# Altium schematic sheet fpga33-serdes-power.SchDoc
size Tabloid; SheetNumber: 70; SheetTotal: 71
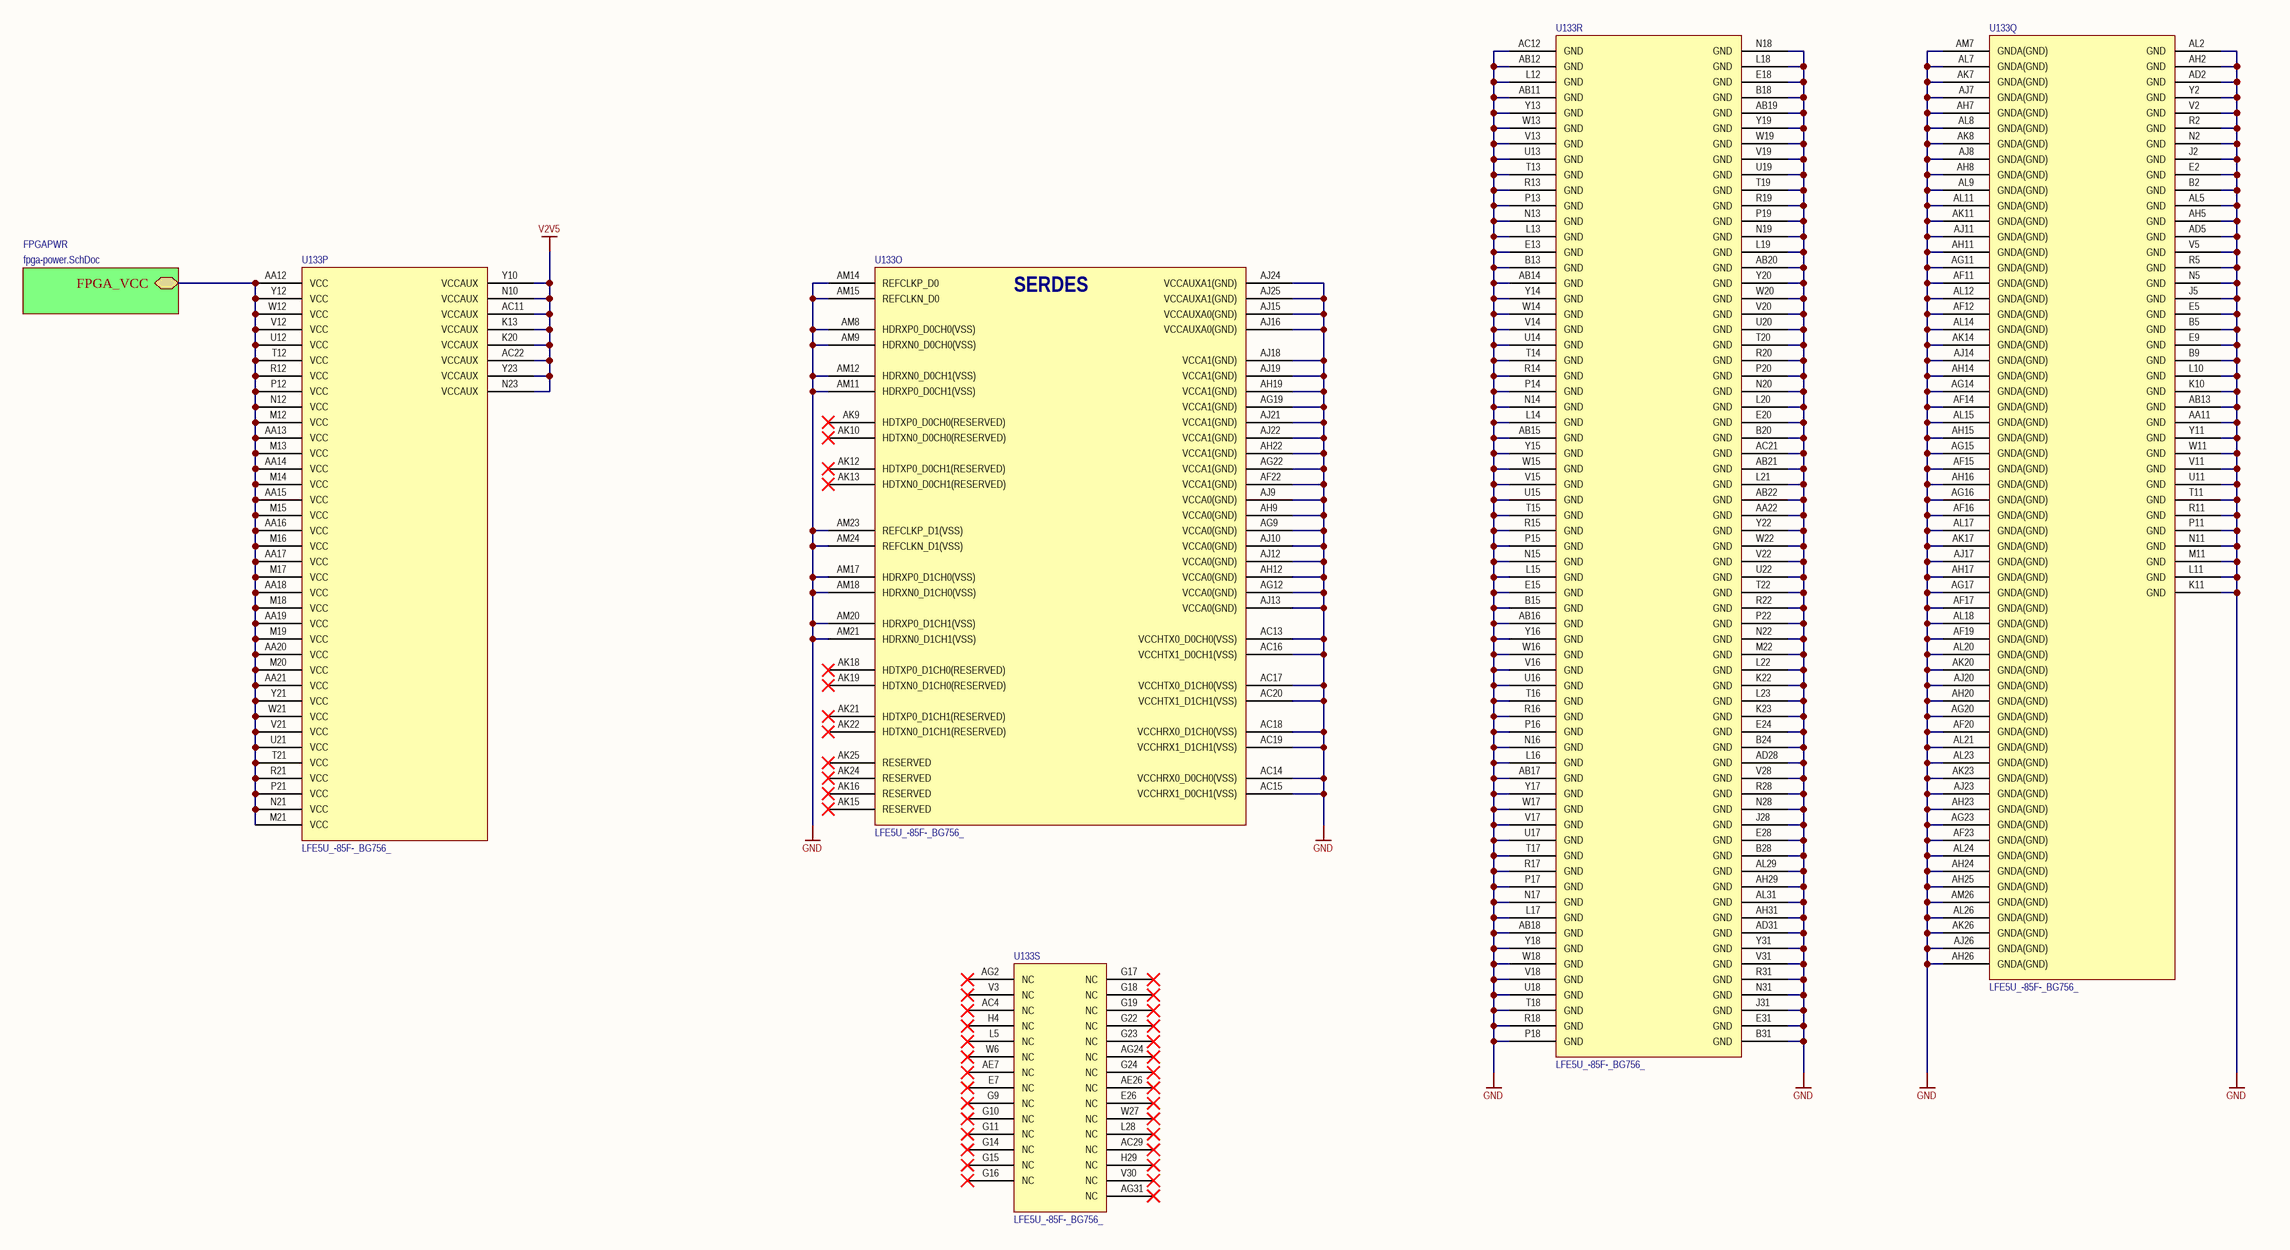
[diagram p0: fpga33-serdes-power.SchDoc]

## Parts
U133  LFE5U_-85F-_BG756_  [caBGA756]  (parts O,P,Q,R,S of 19)

## Sub-sheets
FPGAPWR = fpga-power.SchDoc: FPGA_VCC

## Nets
GND: U133.AA11(GND) U133.AA22(GND) U133.AB11(GND) U133.AB12(GND) U133.AB13(GND) U133.AB14(GND) U133.AB15(GND) U133.AB16(GND) U133.AB17(GND) U133.AB18(GND) U133.AB19(GND) U133.AB20(GND) U133.AB21(GND) U133.AB22(GND) U133.AC12(GND) U133.AC13(VCCHTX0_D0CH0(VSS)) U133.AC14(VCCHRX0_D0CH0(VSS)) U133.AC15(VCCHRX1_D0CH1(VSS)) U133.AC16(VCCHTX1_D0CH1(VSS)) U133.AC17(VCCHTX0_D1CH0(VSS)) U133.AC18(VCCHRX0_D1CH0(VSS)) U133.AC19(VCCHRX1_D1CH1(VSS)) U133.AC20(VCCHTX1_D1CH1(VSS)) U133.AC21(GND) U133.AD2(GND) U133.AD5(GND) U133.AD28(GND) U133.AD31(GND) U133.AF11(GNDA(GND)) U133.AF12(GNDA(GND)) U133.AF14(GNDA(GND)) U133.AF15(GNDA(GND)) U133.AF16(GNDA(GND)) U133.AF17(GNDA(GND)) U133.AF19(GNDA(GND)) U133.AF20(GNDA(GND)) U133.AF22(VCCA1(GND)) U133.AF23(GNDA(GND)) U133.AG9(VCCA0(GND)) U133.AG11(GNDA(GND)) U133.AG12(VCCA0(GND)) U133.AG14(GNDA(GND)) U133.AG15(GNDA(GND)) U133.AG16(GNDA(GND)) U133.AG17(GNDA(GND)) U133.AG19(VCCA1(GND)) U133.AG20(GNDA(GND)) U133.AG22(VCCA1(GND)) U133.AG23(GNDA(GND)) U133.AH2(GND) U133.AH5(GND) U133.AH7(GNDA(GND)) U133.AH8(GNDA(GND)) U133.AH9(VCCA0(GND)) U133.AH11(GNDA(GND)) U133.AH12(VCCA0(GND)) U133.AH14(GNDA(GND)) U133.AH15(GNDA(GND)) U133.AH16(GNDA(GND)) U133.AH17(GNDA(GND)) U133.AH19(VCCA1(GND)) U133.AH20(GNDA(GND)) U133.AH22(VCCA1(GND)) U133.AH23(GNDA(GND)) U133.AH24(GNDA(GND)) U133.AH25(GNDA(GND)) U133.AH26(GNDA(GND)) U133.AH29(GND) U133.AH31(GND) U133.AJ7(GNDA(GND)) U133.AJ8(GNDA(GND)) U133.AJ9(VCCA0(GND)) U133.AJ10(VCCA0(GND)) U133.AJ11(GNDA(GND)) U133.AJ12(VCCA0(GND)) U133.AJ13(VCCA0(GND)) U133.AJ14(GNDA(GND)) U133.AJ15(VCCAUXA0(GND)) U133.AJ16(VCCAUXA0(GND)) U133.AJ17(GNDA(GND)) U133.AJ18(VCCA1(GND)) U133.AJ19(VCCA1(GND)) U133.AJ20(GNDA(GND)) U133.AJ21(VCCA1(GND)) U133.AJ22(VCCA1(GND)) U133.AJ23(GNDA(GND)) U133.AJ24(VCCAUXA1(GND)) U133.AJ25(VCCAUXA1(GND)) U133.AJ26(GNDA(GND)) U133.AK7(GNDA(GND)) U133.AK8(GNDA(GND)) U133.AK11(GNDA(GND)) U133.AK14(GNDA(GND)) U133.AK17(GNDA(GND)) U133.AK20(GNDA(GND)) U133.AK23(GNDA(GND)) U133.AK26(GNDA(GND)) U133.AL2(GND) U133.AL5(GND) U133.AL7(GNDA(GND)) U133.AL8(GNDA(GND)) U133.AL9(GNDA(GND)) U133.AL11(GNDA(GND)) U133.AL12(GNDA(GND)) U133.AL14(GNDA(GND)) U133.AL15(GNDA(GND)) U133.AL17(GNDA(GND)) U133.AL18(GNDA(GND)) U133.AL20(GNDA(GND)) U133.AL21(GNDA(GND)) U133.AL23(GNDA(GND)) U133.AL24(GNDA(GND)) U133.AL26(GNDA(GND)) U133.AL29(GND) U133.AL31(GND) U133.AM7(GNDA(GND)) U133.AM8(HDRXP0_D0CH0(VSS)) U133.AM9(HDRXN0_D0CH0(VSS)) U133.AM11(HDRXP0_D0CH1(VSS)) U133.AM12(HDRXN0_D0CH1(VSS)) U133.AM14(REFCLKP_D0) U133.AM15(REFCLKN_D0) U133.AM17(HDRXP0_D1CH0(VSS)) U133.AM18(HDRXN0_D1CH0(VSS)) U133.AM20(HDRXP0_D1CH1(VSS)) U133.AM21(HDRXN0_D1CH1(VSS)) U133.AM23(REFCLKP_D1(VSS)) U133.AM24(REFCLKN_D1(VSS)) U133.AM26(GNDA(GND)) U133.B2(GND) U133.B5(GND) U133.B9(GND) U133.B13(GND) U133.B15(GND) U133.B18(GND) U133.B20(GND) U133.B24(GND) U133.B28(GND) U133.B31(GND) U133.E2(GND) U133.E5(GND) U133.E9(GND) U133.E13(GND) U133.E15(GND) U133.E18(GND) U133.E20(GND) U133.E24(GND) U133.E28(GND) U133.E31(GND) U133.J2(GND) U133.J5(GND) U133.J28(GND) U133.J31(GND) U133.K10(GND) U133.K11(GND) U133.K22(GND) U133.K23(GND) U133.L10(GND) U133.L11(GND) U133.L12(GND) U133.L13(GND) U133.L14(GND) U133.L15(GND) U133.L16(GND) U133.L17(GND) U133.L18(GND) U133.L19(GND) U133.L20(GND) U133.L21(GND) U133.L22(GND) U133.L23(GND) U133.M11(GND) U133.M22(GND) U133.N2(GND) U133.N5(GND) U133.N11(GND) U133.N13(GND) U133.N14(GND) U133.N15(GND) U133.N16(GND) U133.N17(GND) U133.N18(GND) U133.N19(GND) U133.N20(GND) U133.N22(GND) U133.N28(GND) U133.N31(GND) U133.P11(GND) U133.P13(GND) U133.P14(GND) U133.P15(GND) U133.P16(GND) U133.P17(GND) U133.P18(GND) U133.P19(GND) U133.P20(GND) U133.P22(GND) U133.R2(GND) U133.R5(GND) U133.R11(GND) U133.R13(GND) U133.R14(GND) U133.R15(GND) U133.R16(GND) U133.R17(GND) U133.R18(GND) U133.R19(GND) U133.R20(GND) U133.R22(GND) U133.R28(GND) U133.R31(GND) U133.T11(GND) U133.T13(GND) U133.T14(GND) U133.T15(GND) U133.T16(GND) U133.T17(GND) U133.T18(GND) U133.T19(GND) U133.T20(GND) U133.T22(GND) U133.U11(GND) U133.U13(GND) U133.U14(GND) U133.U15(GND) U133.U16(GND) U133.U17(GND) U133.U18(GND) U133.U19(GND) U133.U20(GND) U133.U22(GND) U133.V2(GND) U133.V5(GND) U133.V11(GND) U133.V13(GND) U133.V14(GND) U133.V15(GND) U133.V16(GND) U133.V17(GND) U133.V18(GND) U133.V19(GND) U133.V20(GND) U133.V22(GND) U133.V28(GND) U133.V31(GND) U133.W11(GND) U133.W13(GND) U133.W14(GND) U133.W15(GND) U133.W16(GND) U133.W17(GND) U133.W18(GND) U133.W19(GND) U133.W20(GND) U133.W22(GND) U133.Y2(GND) U133.Y11(GND) U133.Y13(GND) U133.Y14(GND) U133.Y15(GND) U133.Y16(GND) U133.Y17(GND) U133.Y18(GND) U133.Y19(GND) U133.Y20(GND) U133.Y22(GND) U133.Y31(GND)
V2V5: U133.AC11(VCCAUX) U133.AC22(VCCAUX) U133.K13(VCCAUX) U133.K20(VCCAUX) U133.N10(VCCAUX) U133.N23(VCCAUX) U133.Y10(VCCAUX) U133.Y23(VCCAUX)
NetU133_AA12: U133.AA12(VCC) U133.AA13(VCC) U133.AA14(VCC) U133.AA15(VCC) U133.AA16(VCC) U133.AA17(VCC) U133.AA18(VCC) U133.AA19(VCC) U133.AA20(VCC) U133.AA21(VCC) U133.M12(VCC) U133.M13(VCC) U133.M14(VCC) U133.M15(VCC) U133.M16(VCC) U133.M17(VCC) U133.M18(VCC) U133.M19(VCC) U133.M20(VCC) U133.M21(VCC) U133.N12(VCC) U133.N21(VCC) U133.P12(VCC) U133.P21(VCC) U133.R12(VCC) U133.R21(VCC) U133.T12(VCC) U133.T21(VCC) U133.U12(VCC) U133.U21(VCC) U133.V12(VCC) U133.V21(VCC) U133.W12(VCC) U133.W21(VCC) U133.Y12(VCC) U133.Y21(VCC) ; sheet FPGAPWR/FPGA_VCC

Not connected (* = marked no-connect by the designer): U133 AC4(NC)* AC29(NC)* AE7(NC)* AE26(NC)* AG2(NC)* AG24(NC)* AG31(NC)* AK9(HDTXP0_D0CH0(RESERVED))* AK10(HDTXN0_D0CH0(RESERVED))* AK12(HDTXP0_D0CH1(RESERVED))* AK13(HDTXN0_D0CH1(RESERVED))* AK15(RESERVED)* AK16(RESERVED)* AK18(HDTXP0_D1CH0(RESERVED))* AK19(HDTXN0_D1CH0(RESERVED))* AK21(HDTXP0_D1CH1(RESERVED))* AK22(HDTXN0_D1CH1(RESERVED))* AK24(RESERVED)* AK25(RESERVED)* E7(NC)* E26(NC)* G9(NC)* G10(NC)* G11(NC)* G14(NC)* G15(NC)* G16(NC)* G17(NC)* G18(NC)* G19(NC)* G22(NC)* G23(NC)* G24(NC)* H4(NC)* H29(NC)* L5(NC)* L28(NC)* V3(NC)* V30(NC)* W6(NC)* W27(NC)*

## Notes on the sheet
- (in symbol LFE5U_-85F-_BG756_, part O) SERDES

## Library data of the parts
U133 = LFE5U_-85F-_BG756_: ECP5 FPGA, 85k LUT, 756-caBGA; Manufacturer: Lattice Semiconductor; Manufacturer P/N: LFE5U_-85F-_BG756_